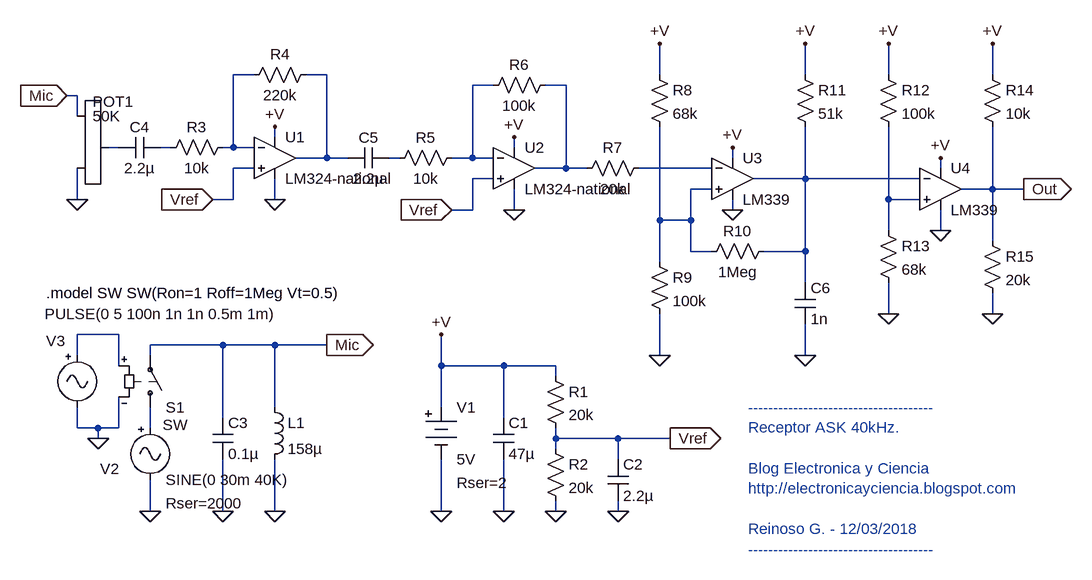
[diagram p0: schematic receiver_digi_pot.asc]
receiver_digi_pot.asc, the LTspice schematic file:
Version 4
SHEET 1 2156 884
WIRE 256 -32 224 -32
WIRE 368 -32 336 -32
WIRE 880 -32 880 -80
WIRE 1104 -32 1104 -80
WIRE 1232 -32 1232 -80
WIRE 1392 -32 1392 -80
WIRE 624 -16 592 -16
WIRE 736 -16 704 -16
WIRE -16 0 -32 0
WIRE -16 32 -16 0
WIRE 288 64 288 48
WIRE 48 80 32 80
WIRE 128 80 112 80
WIRE 224 80 224 -32
WIRE 224 80 208 80
WIRE 256 80 224 80
WIRE 656 80 656 64
WIRE 368 96 368 -32
WIRE 368 96 320 96
WIRE 400 96 368 96
WIRE 480 96 464 96
WIRE 592 96 592 -16
WIRE 592 96 560 96
WIRE 624 96 592 96
WIRE 992 96 992 80
WIRE 256 112 224 112
WIRE 736 112 736 -16
WIRE 736 112 688 112
WIRE 768 112 736 112
WIRE 960 112 848 112
WIRE 1312 112 1312 96
WIRE 624 128 592 128
WIRE 1104 128 1104 48
WIRE 1104 128 1024 128
WIRE 1280 128 1104 128
WIRE 960 144 928 144
WIRE 1392 144 1392 48
WIRE 1392 144 1344 144
WIRE 1440 144 1392 144
WIRE -16 160 -16 112
WIRE 224 160 224 112
WIRE 224 160 192 160
WIRE 288 160 288 128
WIRE 1232 160 1232 48
WIRE 1280 160 1232 160
WIRE 592 176 592 128
WIRE 592 176 560 176
WIRE 656 176 656 144
WIRE 992 176 992 160
WIRE 880 192 880 48
WIRE 928 192 928 144
WIRE 928 192 880 192
WIRE 1232 208 1232 160
WIRE 1312 208 1312 176
WIRE 1392 224 1392 144
WIRE 928 240 928 192
WIRE 960 240 928 240
WIRE 1104 240 1104 128
WIRE 1104 240 1040 240
WIRE 880 256 880 192
WIRE 1104 288 1104 240
WIRE 1232 336 1232 288
WIRE 1392 336 1392 304
WIRE 48 368 -16 368
WIRE 208 384 96 384
WIRE 288 384 208 384
WIRE 368 384 288 384
WIRE -16 400 -16 368
WIRE 96 400 96 384
WIRE 880 400 880 336
WIRE 1104 400 1104 352
WIRE 48 416 48 368
WIRE 544 416 544 368
WIRE 640 416 544 416
WIRE 720 416 640 416
WIRE 720 432 720 416
WIRE 288 480 288 384
WIRE 544 480 544 416
WIRE 208 496 208 384
WIRE 640 496 640 416
WIRE -16 512 -16 480
WIRE 16 512 -16 512
WIRE 48 512 48 464
WIRE 48 512 16 512
WIRE 96 512 96 480
WIRE 16 528 16 512
WIRE 720 528 720 512
WIRE 816 528 720 528
WIRE 896 528 816 528
WIRE 720 544 720 528
WIRE 816 560 816 528
WIRE 96 640 96 592
WIRE 208 640 208 560
WIRE 288 640 288 560
WIRE 544 640 544 560
WIRE 640 640 640 560
WIRE 720 640 720 624
WIRE 816 640 816 624
FLAG 544 640 0
FLAG 368 384 Mic
IOPIN 368 384 Out
FLAG 544 368 +V
FLAG 640 640 0
FLAG 720 640 0
FLAG 896 528 Vref
IOPIN 896 528 Out
FLAG 816 640 0
FLAG 96 640 0
FLAG 16 528 0
FLAG 288 640 0
FLAG 208 640 0
FLAG -32 0 Mic
IOPIN -32 0 In
FLAG 192 160 Vref
IOPIN 192 160 In
FLAG 288 48 +V
FLAG 288 160 0
FLAG 560 176 Vref
IOPIN 560 176 In
FLAG 656 64 +V
FLAG 656 176 0
FLAG 992 80 +V
FLAG 992 176 0
FLAG 880 400 0
FLAG 880 -80 +V
FLAG 1104 400 0
FLAG 1312 96 +V
FLAG 1312 208 0
FLAG 1232 336 0
FLAG 1232 -80 +V
FLAG 1392 -80 +V
FLAG 1104 -80 +V
FLAG 1392 336 0
FLAG 1440 144 Out
IOPIN 1440 144 Out
FLAG -16 160 0
SYMBOL Misc\\signal 96 496 R0
WINDOW 123 0 0 Left 2
WINDOW 39 24 132 Left 2
WINDOW 0 -77 79 Left 2
SYMATTR SpiceLine Rser=2000
SYMATTR InstName V2
SYMATTR Value SINE(0 30m 40K)
SYMBOL res 704 528 R0
SYMATTR InstName R2
SYMATTR Value 20k
SYMBOL res 704 416 R0
SYMATTR InstName R1
SYMATTR Value 20k
SYMBOL Misc\\battery 544 464 R0
WINDOW 123 0 0 Left 2
WINDOW 39 24 132 Left 2
SYMATTR SpiceLine Rser=2
SYMATTR InstName V1
SYMATTR Value 5V
SYMBOL Misc\\signal -16 384 R0
WINDOW 0 -48 -6 Left 2
WINDOW 3 -50 -48 Left 2
WINDOW 123 0 0 Left 2
WINDOW 39 24 132 Left 2
SYMATTR InstName V3
SYMATTR Value PULSE(0 5 100n 1n 1n 0.5m 1m)
SYMBOL sw 96 496 M180
WINDOW 3 19 -11 Left 2
SYMATTR InstName S1
SYMBOL cap 624 496 R0
SYMATTR InstName C1
SYMATTR Value 47µ
SYMBOL cap 800 560 R0
SYMATTR InstName C2
SYMATTR Value 2.2µ
SYMBOL cap 192 496 R0
SYMATTR InstName C3
SYMATTR Value 0.1µ
SYMBOL ind 272 464 R0
SYMATTR InstName L1
SYMATTR Value 158µ
SYMATTR SpiceLine Rser=3
SYMBOL Opamps\\LM324-national 288 32 R0
SYMATTR InstName U1
SYMBOL res 224 64 R90
WINDOW 0 0 56 VBottom 2
WINDOW 3 32 56 VTop 2
SYMATTR InstName R3
SYMATTR Value 10k
SYMBOL cap 112 64 R90
WINDOW 0 0 32 VBottom 2
WINDOW 3 32 32 VTop 2
SYMATTR InstName C4
SYMATTR Value 2.2µ
SYMBOL res 352 -48 R90
WINDOW 0 0 56 VBottom 2
WINDOW 3 32 56 VTop 2
SYMATTR InstName R4
SYMATTR Value 220k
SYMBOL Opamps\\LM324-national 656 48 R0
SYMATTR InstName U2
SYMBOL res 576 80 R90
WINDOW 0 0 56 VBottom 2
WINDOW 3 32 56 VTop 2
SYMATTR InstName R5
SYMATTR Value 10k
SYMBOL cap 464 80 R90
WINDOW 0 0 32 VBottom 2
WINDOW 3 32 32 VTop 2
SYMATTR InstName C5
SYMATTR Value 2.2µ
SYMBOL res 720 -32 R90
WINDOW 0 0 56 VBottom 2
WINDOW 3 32 56 VTop 2
SYMATTR InstName R6
SYMATTR Value 100k
SYMBOL Comparators\\LM339 992 64 R0
SYMATTR InstName U3
SYMBOL cap 1088 288 R0
SYMATTR InstName C6
SYMATTR Value 1n
SYMBOL res 1088 -48 R0
SYMATTR InstName R11
SYMATTR Value 51k
SYMBOL res 1216 -48 R0
SYMATTR InstName R12
SYMATTR Value 100k
SYMBOL res 1216 192 R0
SYMATTR InstName R13
SYMATTR Value 68k
SYMBOL Comparators\\LM339 1312 80 R0
SYMATTR InstName U4
SYMBOL res 1376 -48 R0
SYMATTR InstName R14
SYMATTR Value 10k
SYMBOL res 1056 224 R90
WINDOW 0 0 56 VBottom 2
WINDOW 3 32 56 VTop 2
SYMATTR InstName R10
SYMATTR Value 1Meg
SYMBOL res 864 96 R90
WINDOW 0 0 56 VBottom 2
WINDOW 3 32 56 VTop 2
SYMATTR InstName R7
SYMATTR Value 20k
SYMBOL res 864 -48 R0
SYMATTR InstName R8
SYMATTR Value 68k
SYMBOL res 864 240 R0
SYMATTR InstName R9
SYMATTR Value 100k
SYMBOL res 1376 208 R0
SYMATTR InstName R15
SYMATTR Value 20k
SYMBOL potentiometer_standard -32 16 R0
WINDOW 0 40 -7 Left 2
WINDOW 3 40 16 Left 2
WINDOW 39 48 112 Invisible 2
WINDOW 38 48 41 Invisible 2
SYMATTR InstName POT1
SYMATTR Value 50K
TEXT -64 304 Left 2 !.model SW SW(Ron=1 Roff=1Meg Vt=0.5)
TEXT 1016 480 Left 2 ;-------------------------------------\nReceptor ASK 40kHz.\n \nBlog Electronica y Ciencia\nhttp://electronicayciencia.blogspot.com\n \nReinoso G. - 12/03/2018\n-------------------------------------

The netlist it stands for:
* receiver_digi_pot.asc
V2 N013 0 SINE(0 30m 40K) Rser=2000
R2 Vref 0 20k
R1 +V Vref 20k
V1 +V 0 5V Rser=2
V3 N012 0 PULSE(0 5 100n 1n 1n 0.5m 1m)
S1 N013 Mic N012 0 SW
C1 +V 0 47µ
C2 Vref 0 2.2µ
C3 Mic 0 0.1µ
L1 Mic 0 158µ Rser=3
XU1 Vref N001 +V 0 N002 LM324-national  ; pins In+ In- V+ V- OUT
R3 N001 N006 10k
C4 N006 N005 2.2µ
R4 N002 N001 220k
XU2 Vref N003 +V 0 N004 LM324-national  ; pins In+ In- V+ V- OUT
R5 N003 N007 10k
C5 N007 N002 2.2µ
R6 N004 N003 100k
XU3 N010 N008 +V 0 N009 LM339  ; pins In+ In- V+ V- OUT
C6 N009 0 1n
R11 +V N009 51k
R12 +V N011 100k
R13 N011 0 68k
XU4 N011 N009 +V 0 Out LM339  ; pins In+ In- V+ V- OUT
R14 +V Out 10k
R10 N009 N010 1Meg
R7 N008 N004 20k
R8 +V N010 68k
R9 N010 0 100k
R15 Out 0 20k
XPOT1 Mic 0 N005 50K
.model SW SW(Ron=1 Roff=1Meg Vt=0.5)
* -------------------------------------
* Receptor ASK 40kHz.
* Blog Electronica y Ciencia
* http://electronicayciencia.blogspot.com
* Reinoso G. - 12/03/2018
* -------------------------------------
.lib LM339.sub
.backanno
.end